# EasyEDA schematic LaserTag.json
TITLE: Sheet_1; REV: 1.0; Date: 2023-06-16; Sheet: 1/1; Company: Your Company
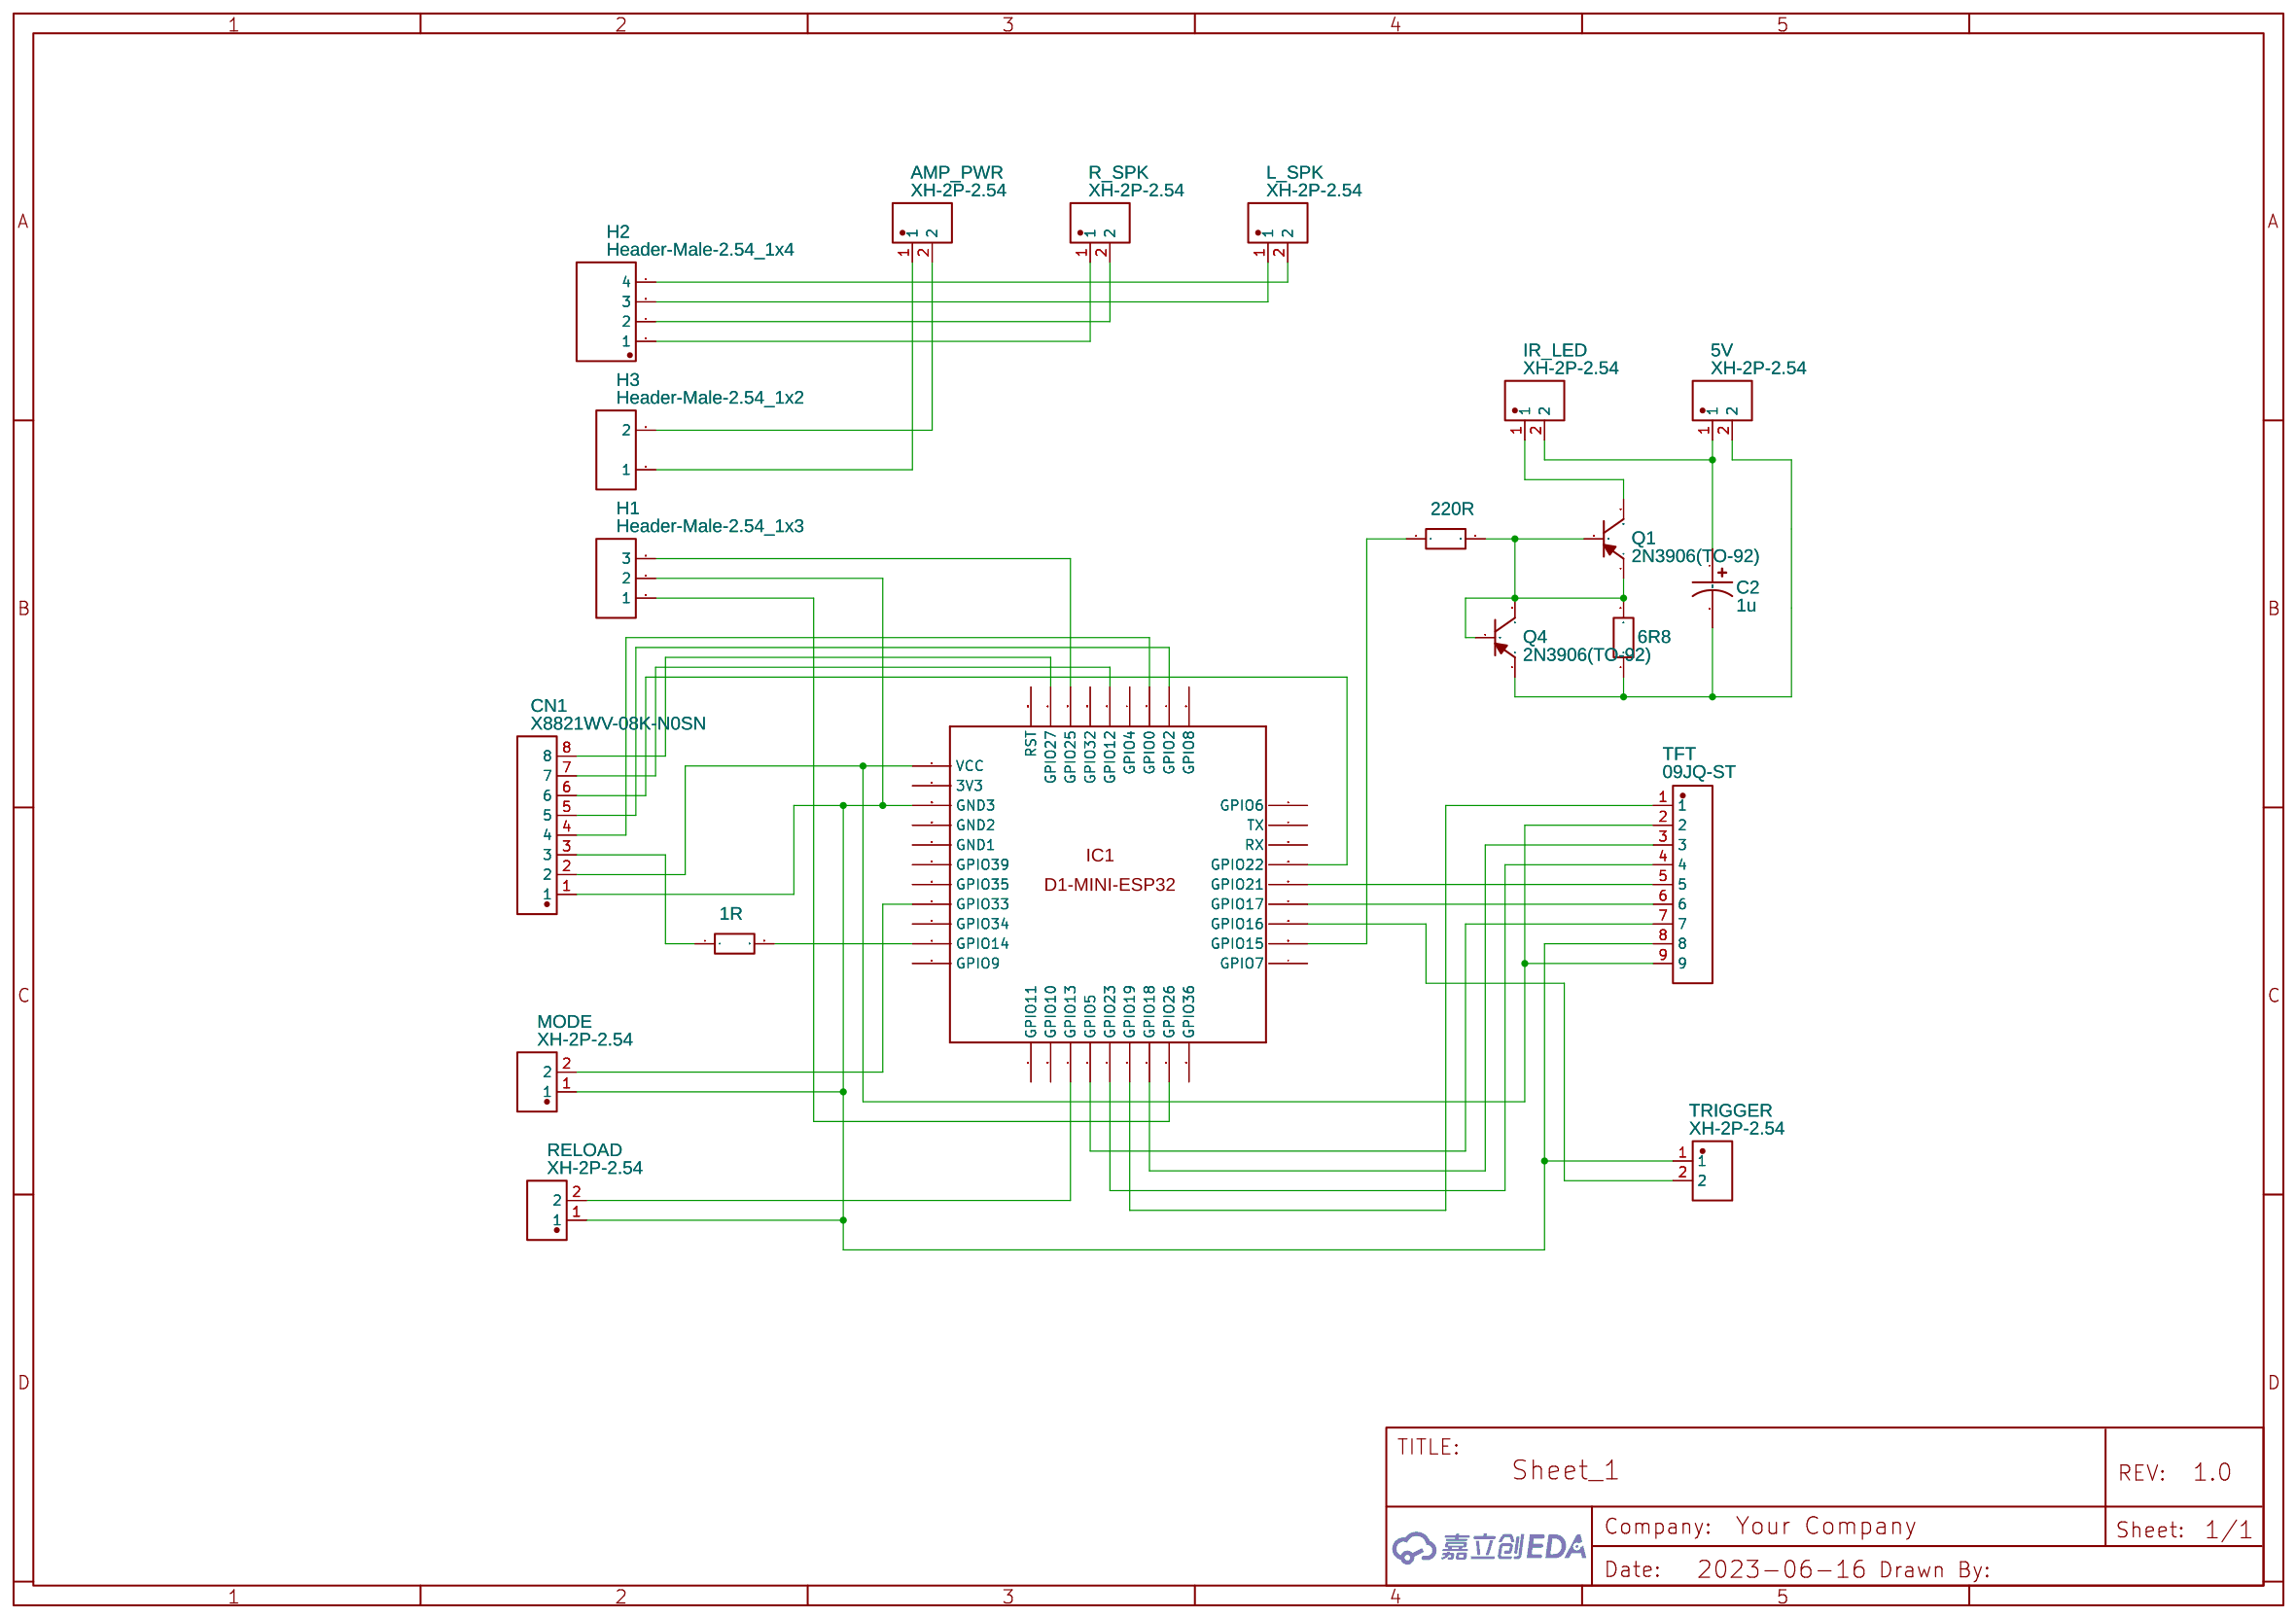
[diagram p0: schematic sheet]

## Parts
1R  ?  [RES-TH_BD2.7-L6.2-P10.20-D0.4]
5V  XH-2P-2.54  [CONN-TH_2P-P2.50-XH2.54-2P]
6R8  ?  [RES-TH_BD2.7-L6.2-P10.20-D0.4]
220R  ?  [RES-TH_BD2.7-L6.2-P10.20-D0.4]
AMP_PWR  XH-2P-2.54  [CONN-TH_2P-P2.50-XH2.54-2P]
C2  1u  [CAP-D6.3×F2.5]
CN1  X8821WV-08K-N0SN  [CONN-TH_8P-P2.50_X8821WV-08K-N0SN]
H1  Header-Male-2.54_1x3  [HDR-TH_3P-P2.54-V-M-1]
H2  Header-Male-2.54_1x4  [HDR-TH_4P-P2.54-V-M]
H3  Header-Male-2.54_1x2  [HDR-TH_2P-P2.54-V-M-1]
IR_LED  XH-2P-2.54  [CONN-TH_2P-P2.50-XH2.54-2P]
L_SPK  XH-2P-2.54  [CONN-TH_2P-P2.50-XH2.54-2P]
MODE  XH-2P-2.54  [CONN-TH_2P-P2.50-XH2.54-2P]
Q1  2N3906(TO-92)  [TO-92-3_L4.9-W3.7-P1.27-L]
Q4  2N3906(TO-92)  [TO-92-3_L4.9-W3.7-P1.27-L]
R_SPK  XH-2P-2.54  [CONN-TH_2P-P2.50-XH2.54-2P]
RELOAD  XH-2P-2.54  [CONN-TH_2P-P2.50-XH2.54-2P]
TFT  09JQ-ST  [CONN-TH_9P-P2.50_X8821WV-09K-N0SN]
TRIGGER  XH-2P-2.54  [CONN-TH_2P-P2.50-XH2.54-2P]
U1  D1-mini-ESP32  [D1-MINI-ESP32]

## Library data of the parts
1R 6R8 220R = MO1/4W-220K±5%-ST52: Supplier: LCSC; Supplier Part: C2857428; Manufacturer: VO(翔胜); link: https://atta.szlcsc.com/upload/public/pdf/source/20200609/C600990_EE085E5D7E4C73997BF830687A2683BE.pdf; Contributor: lcsc; JLCPCB Part Class: Extended Part
5V AMP_PWR IR_LED L_SPK MODE R_SPK RELOAD TRIGGER = XH-2P-2.54: Contributor: LCSC; Convert to PCB: Yes; Add into BOM: Yes; Supplier: LCSC; Supplier Part: C9900003929; Manufacturer: null; JLCPCB Part Class: Extended Part
C2 = CE_TH_D6.3×F2.5_US: Contributor: LCEDA_Lib
CN1 = X8821WV-08K-N0SN: Contributor: LCSC; Supplier: LCSC; Supplier Part: C388753; Manufacturer: XKB Connectivity(中国星坤); JLCPCB Part Class: Extended Part
H1 = Header-Male-2.54_1x3: Supplier: LCSC; Manufacturer: BOOMELE(博穆精密); Supplier Part: C49257; JLCPCB Part Class: Extended Part
H2 = Header-Male-2.54_1x4: Contributor: LCSC; Supplier: LCSC; Manufacturer: Ckmtw(灿科盟); Supplier Part: C124378; JLCPCB Part Class: Extended Part
H3 = Header-Male-2.54_1x2: Supplier: LCSC; Manufacturer: TE Connectivity(美国泰科); Supplier Part: C86471; JLCPCB Part Class: Extended Part
Q1 Q4 = 2N3906(TO-92): Supplier: LCSC; Manufacturer: CJ; Manufacturer Part: 2N3906; Supplier Part: C9809; Contributor: LCEDA_Lib
TFT = 09JQ-ST: Supplier: LCSC; Supplier Part: C5118719; Manufacturer: JST; link: https://atta.szlcsc.com/upload/public/pdf/source/20211104/32EAB11FA0C3892BAC64B0930014D7FC.pdf; Contributor: lcsc
U1 = D1-mini-ESP32: Contributor: mishoeda

## Nets
Net-(1R-1): 1R.1 CN1.3
Net-(1R-2): 1R.2 U1.14(GPIO14)
Net-(5V-1): 5V.1 C2.1 IR_LED.2
Net-(5V-2): 5V.2 6R8.1 C2.2 Q4.1(E)
Net-(6R8-2): 6R8.2 220R.2 Q1.1(E) Q1.2(B) Q4.2(B) Q4.3(C)
Net-(220R-1): 220R.1 U1.15(GPIO15)
Net-(AMP_PWR-1): AMP_PWR.1 H3.1
Net-(AMP_PWR-2): AMP_PWR.2 H3.2
Net-(CN1-1): CN1.1 H1.2 MODE.1 RELOAD.1 TFT.8 TRIGGER.1 U1.GND3
Net-(CN1-2): CN1.2 TFT.2 TFT.9 U1.VCC
Net-(CN1-4): CN1.4 U1.0(GPIO0)
Net-(CN1-5): CN1.5 U1.2(GPIO2)
Net-(CN1-6): CN1.6 U1.22(GPIO22)
Net-(CN1-7): CN1.7 U1.12(GPIO12)
Net-(CN1-8): CN1.8 U1.27(GPIO27)
Net-(H1-1): H1.1 U1.26(GPIO26)
Net-(H1-3): H1.3 U1.25(GPIO25)
Net-(H2-1): H2.1 R_SPK.1
Net-(H2-2): H2.2 R_SPK.2
Net-(H2-3): H2.3 L_SPK.1
Net-(H2-4): H2.4 L_SPK.2
Net-(IR_LED-1): IR_LED.1 Q1.3(C)
Net-(MODE-2): MODE.2 U1.33(GPIO33)
Net-(RELOAD-2): RELOAD.2 U1.13(GPIO13)
Net-(TFT-1): TFT.1 U1.19(GPIO19)
Net-(TFT-3): TFT.3 U1.18(GPIO18)
Net-(TFT-4): TFT.4 U1.23(GPIO23)
Net-(TFT-5): TFT.5 U1.21(GPIO21)
Net-(TFT-6): TFT.6 U1.17(GPIO17)
Net-(TFT-7): TFT.7 U1.5(GPIO5)
Net-(TRIGGER-2): TRIGGER.2 U1.16(GPIO16)

Not connected (* = marked no-connect by the designer): U1 3V3 4(GPIO4) 6(GPIO6) 7(GPIO7) 8(GPIO8) 9(GPIO9) 10(GPIO10) 11(GPIO11) 32(GPIO32) 34(GPIO34) 35(GPIO35) 36(GPIO36) 39(GPIO39) GND1 GND2 RST RX TX
